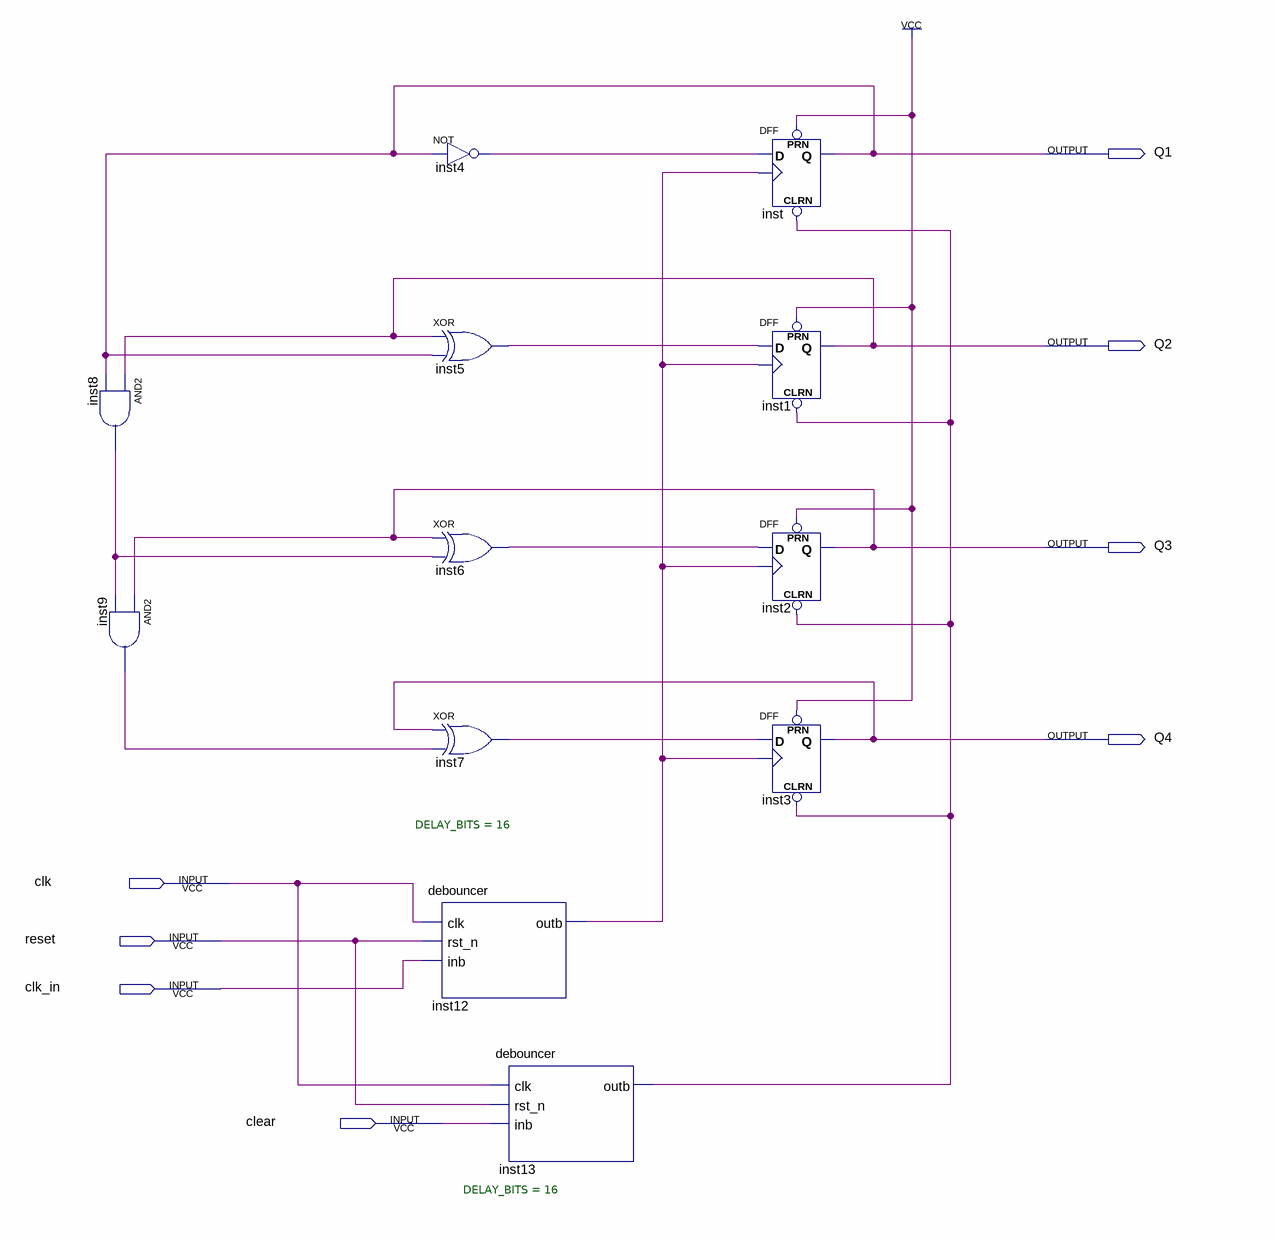
[diagram p0: schematic sheet]
// Quartus schematic sincrono.bdf as structural Verilog: 12 symbols, 8 pins
module sincrono (
  input  clk,
  input  reset,
  input  clk_in,
  input  clear,
  output Q1,
  output Q2,
  output Q3,
  output Q4
);

  wire inst4_out, inst5_out, inst6_out, inst7_out, inst8_out, inst9_out, inst12_outb, inst13_outb;

  and inst8 (inst8_out, Q2, Q1);
  and inst9 (inst9_out, Q3, inst8_out);
  not inst4 (inst4_out, Q1);
  xor inst5 (inst5_out, Q2, Q1);
  xor inst6 (inst6_out, Q3, inst8_out);
  xor inst7 (inst7_out, Q4, inst9_out);
  debouncer #(.DELAY_BITS(16)) inst12 (.clk(clk), .rst_n(reset), .inb(clk_in), .outb(inst12_outb));
  debouncer #(.DELAY_BITS(16)) inst13 (.clk(clk), .rst_n(reset), .inb(clear), .outb(inst13_outb));
  DFF inst (.CLRN(inst13_outb), .CLK(inst12_outb), .D(inst4_out), .PRN(1'b1), .Q(Q1));
  DFF inst1 (.CLRN(inst13_outb), .CLK(inst12_outb), .D(inst5_out), .PRN(1'b1), .Q(Q2));
  DFF inst2 (.CLRN(inst13_outb), .CLK(inst12_outb), .D(inst6_out), .PRN(1'b1), .Q(Q3));
  DFF inst3 (.CLRN(inst13_outb), .CLK(inst12_outb), .D(inst7_out), .PRN(1'b1), .Q(Q4));
endmodule
